# Altium project WizPoE-IO.PrjPcb
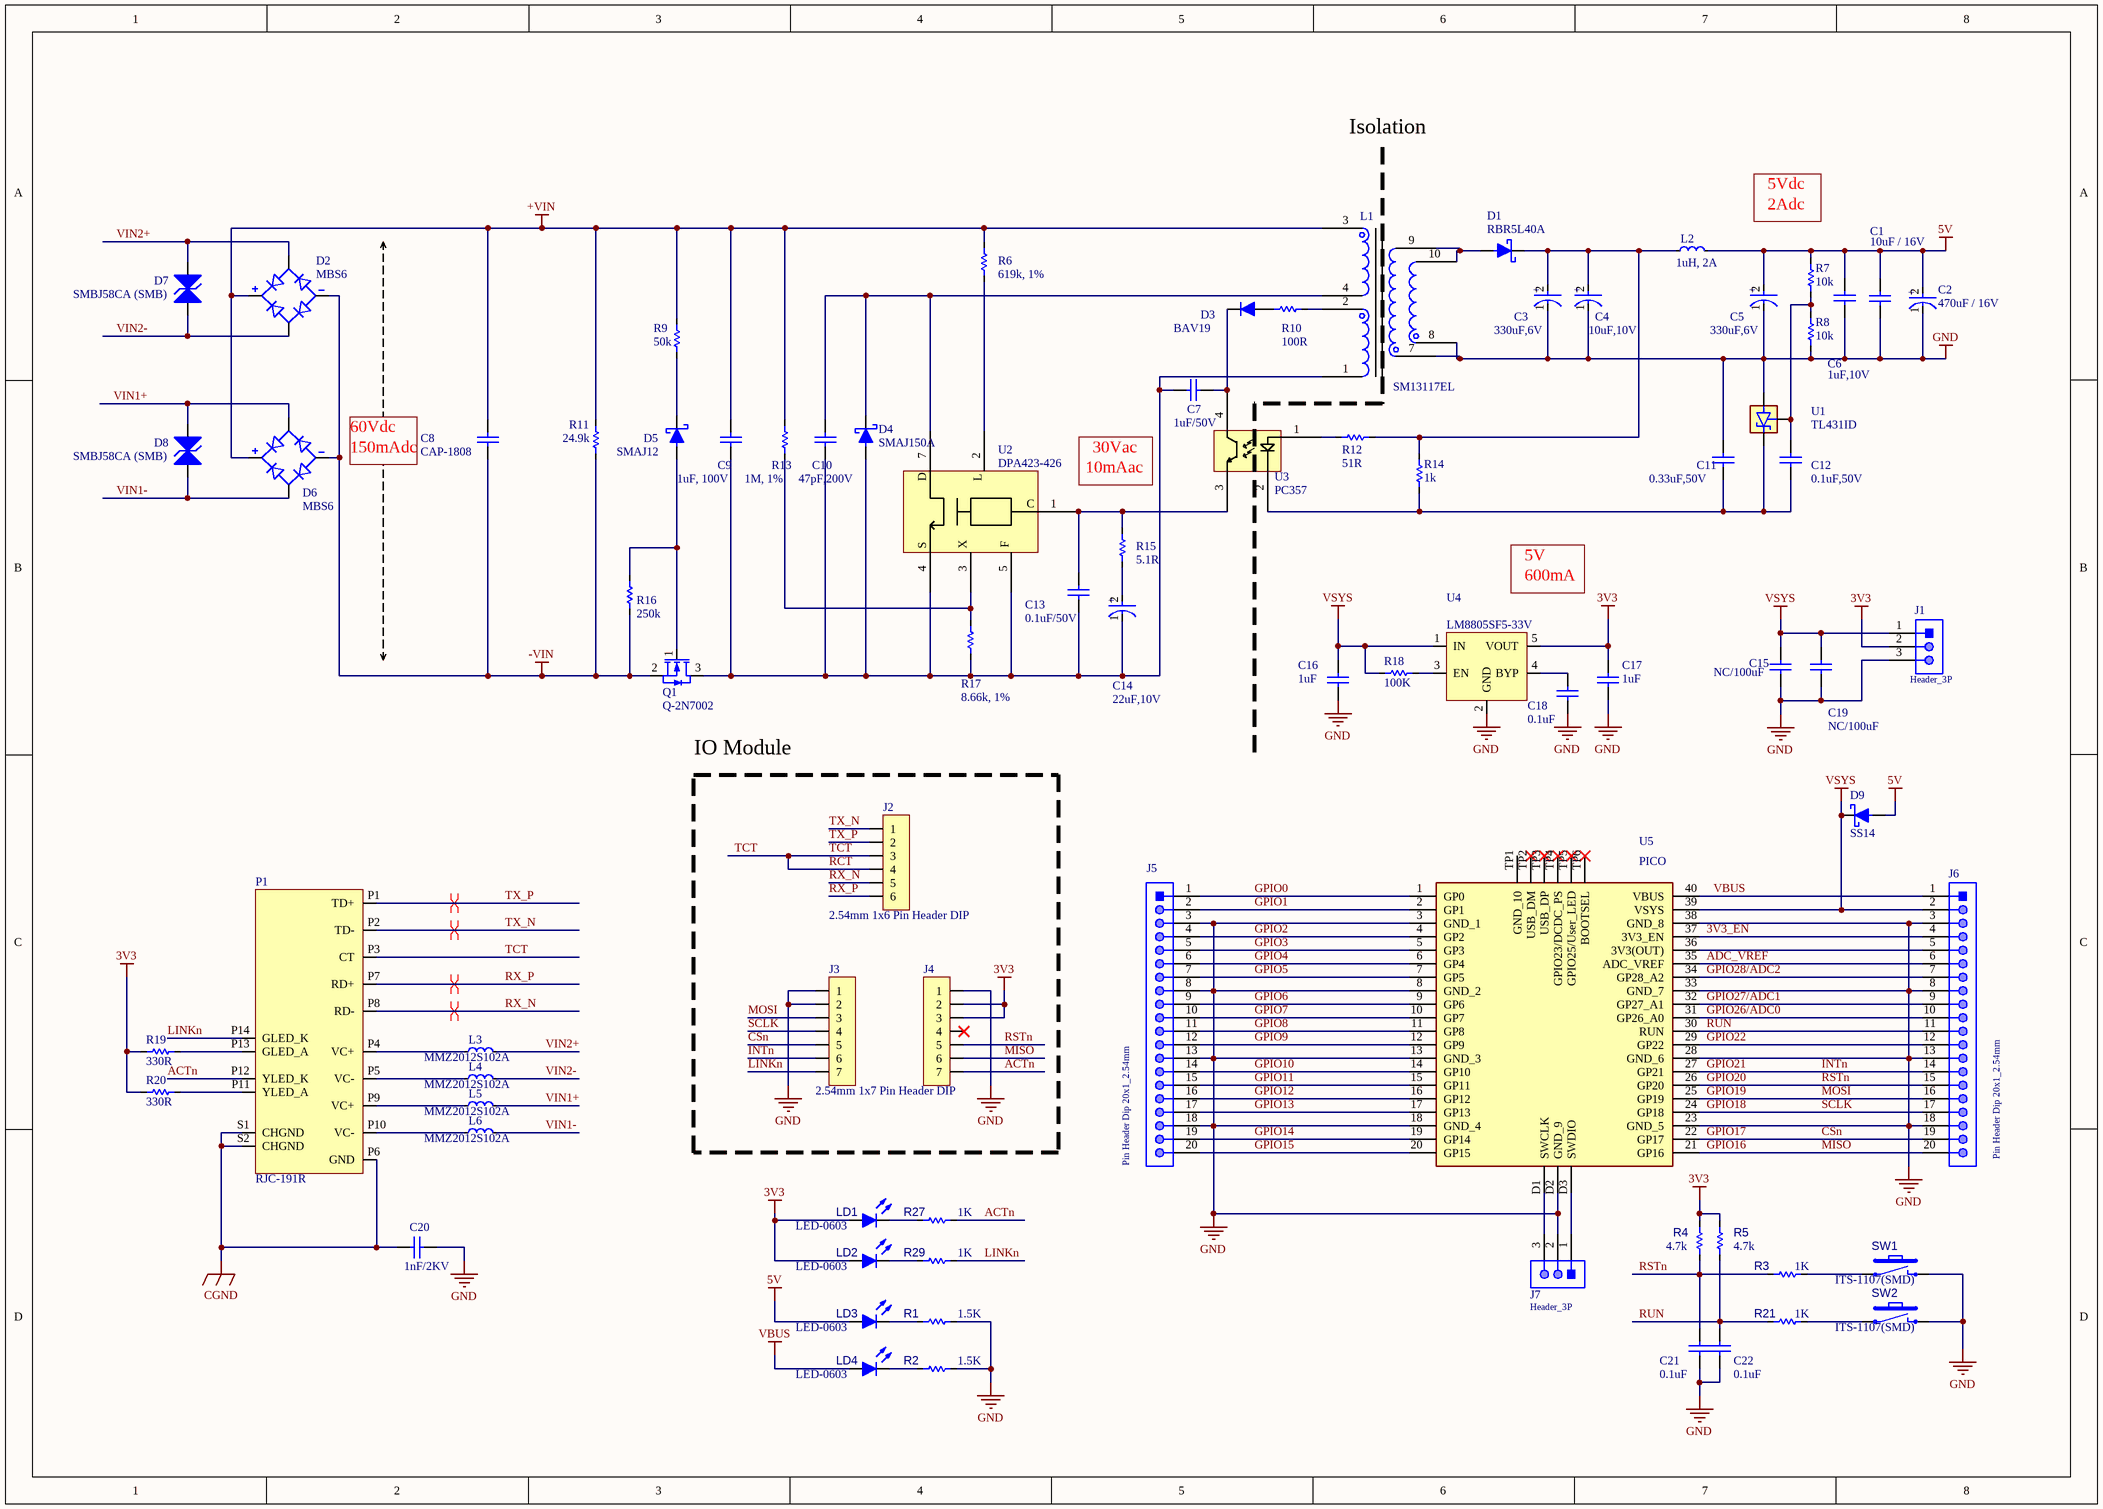
[diagram p0: WizPoE-IO-V001.SchDoc]
1 sheet, 80 parts. Net scope: global (net labels, ports and power ports of the same name join across sheets).
Board file: WizPoE-IO-V001.PcbDoc

## Sheet WizPoE-IO-V001.SchDoc
size A3; SheetNumber: 1; SheetTotal: 1

### Parts
C1  10uF / 16V  [CAP-1808]
C2  470uF / 16V  [CAP-8.3EC]
C3  330uF,6V  [C6032TT(C)]
C4  10uF,10V  [C3216TT(A)]
C5  330uF,6V  [C3216TT(A)]
C6  1uF,10V  [CAP-0603]
C7  1uF/50V  [CAP-0805]
C8  CAP-1808  [CAP-1808]
C9  1uF, 100V  [CAP-0805]
C10  47pF,200V  [CAP-0805]
C11  0.33uF,50V  [CAP-0603]
C12  0.1uF,50V  [CAP-0603]
C13  0.1uF/50V  [CAP-0805]
C14  22uF,10V  [C3216TT(A)]
C15  NC/100uF  [CAP-1808]
C16  1uF  [CAP-0603]
C17  1uF  [CAP-0603]
C18  0.1uF  [CAP-0603]
C19  NC/100uF  [CAP-1808]
C20  1nF/2KV  [CAP-1808]
C21  0.1uF  [CAP-0603]
C22  0.1uF  [CAP-0603]
D1  RBR5L40A  [DO-214AB/SMC]
D2  MBS6  [TO-269AA(MBS)]
D3  BAV19  [SOD-123(1-C,2-A)]
D4  SMAJ150A  [DO-214AC/SMA]
D5  SMAJ12  [DO-214AC/SMA]
D6  MBS6  [TO-269AA(MBS)]
D7  SMBJ58CA (SMB)  [DO-214AA/SMB(TVS)]
D8  SMBJ58CA (SMB)  [DO-214AA/SMB(TVS)]
D9  SS14  [DO-214AC/SMA]
J1  Header_3P  [IDC-1X3]
J2  2.54mm 1x6 Pin Header DIP  [IDC-1X6]
J3  2.54mm 1x7 Pin Header DIP  [IDC-1X7]
J4  2.54mm 1x7 Pin Header DIP  [IDC-1X7-1]  (value not drawn)
J5  Pin Header Dip 20x1_2.54mm  [IDC-1X20]
J6  Pin Header Dip 20x1_2.54mm  [IDC-1X20]
J7  Header_3P  [IDC-1X3]
L1  SM13117EL  [SM13117EL]
L2  1uH, 2A  [IND-0805]
L3  MMZ2012S102A  [IND-0805]
L4  MMZ2012S102A  [IND-0805]
L5  MMZ2012S102A  [IND-0805]
L6  MMZ2012S102A  [IND-0805]
LD1  LED-0603  [LED-0603-RED]
LD2  LED-0603  [LED-0603-RED]
LD3  LED-0603  [LED-0603-RED]
LD4  LED-0603  [LED-0603-RED]
P1  RJC-191R  [RJC-191R]
Q1  Q-2N7002  [SOT23-3L]
R1  1.5K  [RES-0603]
R2  1.5K  [RES-0603]
R3  1K  [RES-0603]
R4  4.7k  [RES-0603]
R5  4.7k  [RES-0603]
R6  619k, 1%  [RES-0603]
R7  10k  [RES-0603]
R8  10k  [RES-0603]
R9  50k  [RES-2012]
R10  100R  [RES-2012]
R11  24.9k  [RES-2012]
R12  51R  [RES-2012]
R13  1M, 1%  [RES-0603]
R14  1k  [RES-2012]
R15  5.1R  [RES-2012]
R16  250k  [RES-2012]
R17  8.66k, 1%  [RES-0603]
R18  100K  [RES-0603]
R19  330R  [RES-0603]
R20  330R  [RES-0603]
R21  1K  [RES-0603]
R27  1K  [RES-0603]
R29  1K  [RES-0603]
SW1  ITS-1107(SMD)  [IT-1107(SMD)]
SW2  ITS-1107(SMD)  [IT-1107(SMD)]
U1  TL431ID  [SOT23-3L]
U2  DPA423-426  [TO-263-7C]
U3  PC357  [PC357]
U4  LM8805SF5-33V  [SOT-23-5L]
U5  PICO  [PICO]

### Blocks framed on the sheet
IO Module: J2-J4

### Nets
3V3: C17.2 J1.2 J4.2 J4.3 LD1.1(A) LD2.1(A) R4.1 R5.1 R19.1 R20.2 U4.5(VOUT)
5V: C1.1 C2.2(A) C5.2(A) C6.2 D9.1(A) L2.2 LD3.1(A) R7.1
+VIN: C8.2 C9.2 D2.POS D6.POS L1.3 R6.2 R9.2 R11.2 R13.2
-VIN: C8.1 D2.NEG D6.NEG Q1.2(S) R11.1 R16.1
CGND: C20.1 P1.P6(GND) P1.S1(CHGND) P1.S2(CHGND)
GND: C1.2 C2.1(C) C3.1(C) C4.1(C) C5.1(C) C6.1 C11.2 C15.1 C16.1 C17.1 C18.1 C19.1 C20.2 C21.1 C22.1 J1.3 J3.1 J3.2 J4.1 J5.3 J5.8 J5.13 J5.18 J6.3 J6.8 J6.13 J6.18 J7.2 L1.7 L1.8 R1.1 R2.1 R8.2 SW1.2 SW2.2 U1.3(ANODE) U4.2(GND) U5.3(GND_1) U5.8(GND_2) U5.13(GND_3) U5.18(GND_4) U5.23(GND_5) U5.28(GND_6) U5.33(GND_7) U5.38(GND_8) U5.D2(GND_9)
VBUS: J6.1 LD4.1(A) U5.40(VBUS)
VSYS: C15.2 C16.2 C19.2 D9.2(C) J1.1 J6.2 R18.1 U4.1(IN) U5.39(VSYS)
3V3_EN: J6.4 U5.37(3V3_EN)
ACTn: J4.7 P1.P12(YLED_K) R27.1
ADC_VREF: J6.6 U5.35(ADC_VREF)
CSn: J3.5 J6.19 U5.22(GP17)  [also labelled GPIO17]
GPIO0: J5.1 U5.1(GP0)
GPIO1: J5.2 U5.2(GP1)
GPIO2: J5.4 U5.4(GP2)
GPIO3: J5.5 U5.5(GP3)
GPIO4: J5.6 U5.6(GP4)
GPIO5: J5.7 U5.7(GP5)
GPIO6: J5.9 U5.9(GP6)
GPIO7: J5.10 U5.10(GP7)
GPIO8: J5.11 U5.11(GP8)
GPIO9: J5.12 U5.12(GP9)
GPIO10: J5.14 U5.14(GP10)
GPIO11: J5.15 U5.15(GP11)
GPIO12: J5.16 U5.16(GP12)
GPIO13: J5.17 U5.17(GP13)
GPIO14: J5.19 U5.19(GP14)
GPIO15: J5.20 U5.20(GP15)
GPIO16: J4.6 J6.20 U5.21(GP16)  [also labelled MISO]
GPIO18: J3.4 J6.17 U5.24(GP18)  [also labelled SCLK]
GPIO19: J3.3 J6.16 U5.25(GP19)  [also labelled MOSI]
GPIO20: C21.2 J4.5 J6.15 R3.2 R4.2 U5.26(GP20)  [also labelled RSTn]
GPIO21: J3.6 J6.14 U5.27(GP21)  [also labelled INTn]
GPIO22: J6.12 U5.29(GP22)
GPIO26/ADC0: J6.10 U5.31(GP26_A0)
GPIO27/ADC1: J6.9 U5.32(GP27_A1)
GPIO28/ADC2: J6.7 U5.34(GP28_A2)
LINKn: J3.7 P1.P14(GLED_K) R29.1
RCT: J2.3 J2.4 P1.P3(CT)  [also labelled TCT]
RUN: C22.2 J6.11 R5.2 R21.2 U5.30(RUN)
RX_N: J2.5 P1.P8(RD-)
RX_P: J2.6 P1.P7(RD+)
TX_N: J2.1 P1.P2(TD-)
TX_P: J2.2 P1.P1(TD+)
VIN1+: D6.AC1 D8.2(A2) L5.2
VIN1-: D6.AC2 D8.1(A1) L6.2
VIN2+: D2.AC1 D7.2(A2) L3.2
VIN2-: D2.AC2 D7.1(A1) L4.2
NetC3_2: C3.2(A) C4.2(A) D1.2(K) L2.1 R12.1 R14.1
NetC7_1: C7.1 D3.1(K) U3.4
NetC7_2: C7.2 C9.1 C10.1 C13.1 C14.1(C) D4.1(A) L1.1 Q1.3(D) R17.1 U2.4(S) U2.5(F)
NetC10_2: C10.2 D4.2(K) L1.4 U2.7(D)
NetC11_1: C11.1 C12.1 R14.2 U1.1(CATHODE) U3.2
NetC12_2: C12.2 R7.2 R8.1 U1.2(REF)
NetC13_2: C13.2 R15.2 U2.1(C) U3.3
NetC14_2: C14.2(A) R15.1
NetC18_2: C18.2 U4.4(BYP)
NetD1_1: D1.1(A) L1.9 L1.10
NetD3_2: D3.2(A) R10.2
NetD5_1: D5.1(A) Q1.1(G) R16.2
NetD5_2: D5.2(K) R9.1
NetJ6_5: J6.5 U5.36(3V3(OUT))
NetJ7_1: J7.1 U5.D3(SWDIO)
NetJ7_3: J7.3 U5.D1(SWCLK)
NetL1_2: L1.2 R10.1
NetL3_1: L3.1 P1.P4(VC+)
NetL4_1: L4.1 P1.P5(VC-)
NetL5_1: L5.1 P1.P9(VC+)
NetL6_1: L6.1 P1.P10(VC-)
NetLD1_2: LD1.2(K) R27.2
NetLD2_2: LD2.2(K) R29.2
NetLD3_2: LD3.2(K) R1.2
NetLD4_2: LD4.2(K) R2.2
NetP1_P11: P1.P11(YLED_A) R20.1
NetP1_P13: P1.P13(GLED_A) R19.2
NetR3_1: R3.1 SW1.1
NetR6_1: R6.1 U2.2(L)
NetR12_2: R12.2 U3.1
NetR13_1: R13.1 R17.2 U2.3(X)
NetR18_2: R18.2 U4.3(EN)
NetR21_1: R21.1 SW2.1

Not connected (* = marked no-connect by the designer): J4 4*; U5 TP1(GND_10) TP2(USB_DM)* TP3(USB_DP)* TP4(GPIO23/DCDC_PS)* TP5(GPIO25/User_LED)* TP6(BOOTSEL)*

### Layout directives
differential pair: RX_N, RX_P, TX_N, TX_P

### Notes on the sheet
- Isolation
- 5Vdc
- 2Adc
- (near D6) 60Vdc
- (near D6) 150mAdc
- 30Vac
- 10mAac
- 5V
- 600mA
- (in symbol AL-CAP-D 8.0mm_SMD) +
- (in symbol TANTAL_CASE A(3216)) +

### Library data of the parts
C1 C8 C15 C19 C20 = CAP-1808: MLCC-1808(4520)
C2 = AL-CAP-D 8.0mm_SMD: AL-CAP D: 8.0mm SMD; Leakage Current: 1uA; Dissipation Factor: 6%; Dielectric Material: Tantalum; Voltage Rating: 10V; Polarity: Polar; Capacitance: 10uF; Life (Hours): 2000Hour; Tolerance: 20%; ESR (Equivalent Series Resistance): 4R; Number of Pins: 2; Package Quantity: 2000; Depth: 1.6mm; Radiation Hardening: No; Mount: Surface Mount; Case/Package: 1206; Features: General Purpose; Case Code (Imperial): 1206; Series: T491; Case Code (Metric): 3216; Height: 1.6mm; Voltage Rating (DC): 10V; Width: 0.063inch; Lead Pitch: 1.2mm; Length: 3.2mm; Height - Seated (Max): 0.071inch; Size: 1.6mm; Min Operating Temperature: -55°C; Packaging: Tape and Reel; Weight: 0.000571oz; Construction: Flat; Voltage: 10V; Termination: SMD/SMT; Max Operating Temperature: 125°C; Lead Free: Lead Free; REACH SVHC: No SVHC; RoHS Compliant: Yes
C3 C5 = TANTAL_CASE A(3216): Leakage Current: 1uA; Dissipation Factor: 6%; Dielectric Material: Tantalum; Voltage Rating: 10V; Polarity: Polar; Capacitance: 10uF; Life (Hours): 2000Hour; Tolerance: 20%; ESR (Equivalent Series Resistance): 4R; Number of Pins: 2; Package Quantity: 2000; Depth: 1.6mm; Radiation Hardening: No; Mount: Surface Mount; Case/Package: 1206; Features: General Purpose; Case Code (Imperial): 1206; Series: T491; Case Code (Metric): 3216; Height: 1.6mm; Voltage Rating (DC): 10V; Width: 0.063inch; Lead Pitch: 1.2mm; Length: 3.2mm; Height - Seated (Max): 0.071inch; Size: 1.6mm; Min Operating Temperature: -55°C; Packaging: Tape and Reel; Weight: 0.000571oz; Construction: Flat; Voltage: 10V; Termination: SMD/SMT; Max Operating Temperature: 125°C; Lead Free: Lead Free; REACH SVHC: No SVHC; RoHS Compliant: Yes
C4 = TANTAL_CASE A(3216): Leakage Current: 1uA; Dissipation Factor: 6%; Dielectric Material: Tantalum; Polarity: Polar; Life (Hours): 2000Hour; Tolerance: 20%; ESR (Equivalent Series Resistance): 4R; Number of Pins: 2; Package Quantity: 2000; Depth: 1.6mm; Radiation Hardening: No; Mount: Surface Mount; Case/Package: 1206; Features: General Purpose; Case Code (Imperial): 1206; Voltage Rating: 10V; Series: T491; Case Code (Metric): 3216; Height: 1.6mm; Voltage Rating (DC): 10V; Width: 0.063inch; Lead Pitch: 1.2mm; Length: 3.2mm; Height - Seated (Max): 0.071inch; Capacitance: 10uF; Size: 1.6mm; Min Operating Temperature: -55°C; Packaging: Tape and Reel; Weight: 0.000571oz; Construction: Flat; Voltage: 10V; Termination: SMD/SMT; Max Operating Temperature: 125°C; Lead Free: Lead Free; REACH SVHC: No SVHC; RoHS Compliant: Yes
C6 C11 C12 C16-C18 C21 C22 = CAP-0603: MLCC-0603(1608)
C7 C9 C10 C13 = CAP-0805: MLCC-0805(2012)
C14 = TANTAL_CASE A(3216): Leakage Current: 1uA; Dissipation Factor: 6%; Dielectric Material: Tantalum; Polarity: Polar; Capacitance: 10uF; Life (Hours): 2000Hour; Tolerance: 20%; ESR (Equivalent Series Resistance): 4R; Number of Pins: 2; Package Quantity: 2000; Depth: 1.6mm; Radiation Hardening: No; Mount: Surface Mount; Case/Package: 1206; Features: General Purpose; Case Code (Imperial): 1206; Voltage Rating: 10V; Series: T491; Case Code (Metric): 3216; Height: 1.6mm; Voltage Rating (DC): 10V; Width: 0.063inch; Lead Pitch: 1.2mm; Length: 3.2mm; Height - Seated (Max): 0.071inch; Size: 1.6mm; Min Operating Temperature: -55°C; Packaging: Tape and Reel; Weight: 0.000571oz; Construction: Flat; Voltage: 10V; Termination: SMD/SMT; Max Operating Temperature: 125°C; Lead Free: Lead Free; REACH SVHC: No SVHC; RoHS Compliant: Yes
D1 D4 D5 = DIODE-Shottky (SOD-323): Silicon Schottky Diode
D3 = DIODE-BAT60A: Silicon Schottky Diode
D7 D8 = DIODE-TVS (SMB): PartNumber: SMAJ58CA-E3/61; Manufacturer: Vishay Semiconductor; Manufacturer: Vishay Semiconductors; PPPM (W): 400, 300; ID (uA): 2; IFSM: 40 A; VWM (V): 58; VBR Bi-Directional (V): 6.4 to 231; Packing: Tape and Reel; ComponentLink1Description: Manufacturer URL; PackageDescription: 2-Pin DO-214AC (SMA), Body 4.245 x 2.665 mm; DatasheetVersion: 12/8/2013; ComponentLink2Description: Datasheet; ComponentLink2URL: http://www.vishay.com/docs/88390/smaj50a.pdf; ComponentLink3Description: Package Specification; ComponentLink3URL: http://www.vishay.com/docs/88390/smaj50a.pdf; Operating Junction and Storage Temperature Range: -55 to 150 degC; PackageReference: DO-214AC-2; RoHS: TRUE; ComponentLink1URL: http://www.vishay.com/; Mounting Technology: Surface Mount; Manufacturer Part Number: SMAJ58CA-E3/61
D9 = DIODE-Shottky SMA(DO-214AC): DIODE SCHOTTKY 40V 1A SMA; Manufacturer: ON Semiconductor; Peak Reverse Current: 0.2mA; Max Junction Temp: +125°C; Standoff Height: 0.05mm; Max Surge Forward Current: 40A; Mouser Description: Schottky Diodes & Rectifiers SMA 40V 1.0A; RoHS: TRUE; Lead Free: Yes; Manufacturer Part Number: SS14; Device Class L3: Schottky Diodes; Category: Diode; Automotive: No; Digikey Description: DIODE SCHOTTKY 40V 1A SMA; ComponentLink2Description: Datasheet; Device Class L2: Diodes; Height: 2.5mm; Temperature Range High: +125°C; ComponentLink2URL: https://www.onsemi.com/pub/Collateral/SS19-D.PDF; Device Class L1: Discrete Semiconductors; Package: 403AE; Octopart: https://octopart.com/ss14-on+semiconductor-29205033; Max Repetitive Reverse Voltage: 40V; Temperature Range Low: -65°C; Forward Current: 1A; Temperature: -65°C to +125°C
J1 J7 = Pin Header 3x1_2.54mm: THT Vertical Pin Header WR-PHD, Pitch 2.54 mm, Single Row, 3 pins; Part Number: 61300311121; Manufacturer: Wurth Elektronik; Withstanding Voltage: 500VAC; Working Voltage: 250VAC; Rated Current: 3A; Pitch: 2.54mm; Pin Number: 3; Gender: Male; Contact Resistance: 20mOhm; Package Reference: 61300311121; Manufacturer URL: http://www.we-online.de; Datasheet URL: https://katalog.we-online.de/em/datasheet/6130xx11121.pdf; Operating Temperature: -40to105degC; Orientation: Vertical; Packaging: Bag; Row Number: Single; Mounting Technology: THT; Publisher: WurthElektronik
J5 J6 = Pin Header 20x1_2.54mm: THT Vertical Pin Header WR-PHD, Pitch 2.54 mm, Single Row, 20 pins; Manufacturer: Wurth Elektronik; Part Number: 61302011121; Withstanding Voltage: 500VAC; Gender: Male; Pin Number: 20; Rated Current: 3A; Contact Resistance: 20mOhm; Pitch: 2.54mm; Working Voltage: 250VAC; Publisher: WurthElektronik; Packaging: Bag; Datasheet URL: https://katalog.we-online.de/em/datasheet/6130xx11121.pdf; Row Number: Single; Mounting Technology: THT; Manufacturer URL: http://www.we-online.de; Orientation: Vertical; Package Reference: 61302011121; Operating Temperature: -40to105degC
L2 = IND-0805: Inductor 0805(2012)
L3-L6 = IND-0603: Inductor 0603(1608)
P1 = RJC-191R: PoE RJ45
Q1 = Q-2N7002: N-Channel 60-V (D-S) MOSFET
R1-R5 R21 R27 R29 = RES-0603: RES0603
R6 R13 R17 = RES-0603: Chip Resistor 0603(1608); Manufacturer: Yageo; Power Rating: 100mW; Voltage Rating: 50V; Temperature Coefficient: 100ppm/degreesC; Resistance: 1.5KOhm; Military Standard: Not; Datasheet URL: http://www.yageo.com/NewPortal/yageodocoutput?fileName=/pdf/R-Chip/PYu-RC_Group_51_RoHS_L_5.pdf; Package Description: 2-Pin Surface Mount Device, Body 1.6 x 0.8 mm; Composition: ThickFilm; Case Code (Metric): 1608; Case/Package: 0603; Number of Terminations: 2; Depth: 0.8mm; Height: 0.022inch; Manufacturer URL: http://www.yageo.com/; Lead Free: LeadFree; Min Operating Temperature: -55degC; Max Operating Temperature: 155degC; Datasheet Version: Rev. 5, 10/2016; RoHSCompliant: true; Max Power Dissipation: 100mW; Packaging: TapeandReel; Voltage Rating (DC): 50V; Length: 0.063inch; Tolerance: 1%; Width: 0.031inch; Number of Pins: 2; Termination: SMD/SMT; Package Reference: 0603; Package Quantity: 1; Case Code (Imperial): 0603; REACH SVHC: NoSVHC
R7 R8 R18-R20 = RES-0603: Chip Resistor 0603(1608); Manufacturer: Yageo; Power Rating: 100mW; Voltage Rating: 50V; Tolerance: 1%; Temperature Coefficient: 100ppm/degreesC; Resistance: 1.5KOhm; Military Standard: Not; Datasheet URL: http://www.yageo.com/NewPortal/yageodocoutput?fileName=/pdf/R-Chip/PYu-RC_Group_51_RoHS_L_5.pdf; Package Description: 2-Pin Surface Mount Device, Body 1.6 x 0.8 mm; Composition: ThickFilm; Case Code (Metric): 1608; Case/Package: 0603; Number of Terminations: 2; Depth: 0.8mm; Height: 0.022inch; Manufacturer URL: http://www.yageo.com/; Lead Free: LeadFree; Min Operating Temperature: -55degC; Max Operating Temperature: 155degC; Datasheet Version: Rev. 5, 10/2016; RoHSCompliant: true; Max Power Dissipation: 100mW; Packaging: TapeandReel; Voltage Rating (DC): 50V; Length: 0.063inch; Width: 0.031inch; Number of Pins: 2; Termination: SMD/SMT; Package Reference: 0603; Package Quantity: 1; Case Code (Imperial): 0603; REACH SVHC: NoSVHC
R9-R12 R14-R16 = RES-2012: Chip Resistor 0805(2012)
SW1 SW2 = ITS-1107(SMD): TACT Switch (SMD)
U1 = TL431IDBZT: Adjustable precision shunt regulator 3-SOT-23 -40 to 85; MF: Texas Instruments; Price: None; Package: SOT-23-3 Texas Instruments; Check_prices: https://www.snapeda.com/parts/TL431IDBZT/Texas%20Instruments/view-part/1206577/?ref=eda; Availability: Warning; MP: TL431IDBZT; Value: *; SnapEDA_Link: https://www.snapeda.com/parts/TL431IDBZT/Texas%20Instruments/view-part/1206577/?ref=snap; Purchase-URL: https://pricing.snapeda.com/search/part/TL431IDBZT/?ref=eda
U2 = DPA423: Highly Integrated DC-DC Converter ICs for Power over Ethernet & Telecom Applications
U4 = LM8805SF5-33V: 600mA CMOS LDO Regulator
U5 = PICO: Module; Manufacturer_Name: RASPBERRY-PI; Datasheet Link: https://datasheets.raspberrypi.org/pico/pico_datasheet.pdf; Height: 1mm; Manufacturer_Part_Number: PICO
D2 D6 = MBS6: Price: None; Availability: Unavailable; Value: *; MP: MBS6; Package: None